# EAGLE schematic dig100-logic (EAGLE 7.2.0)
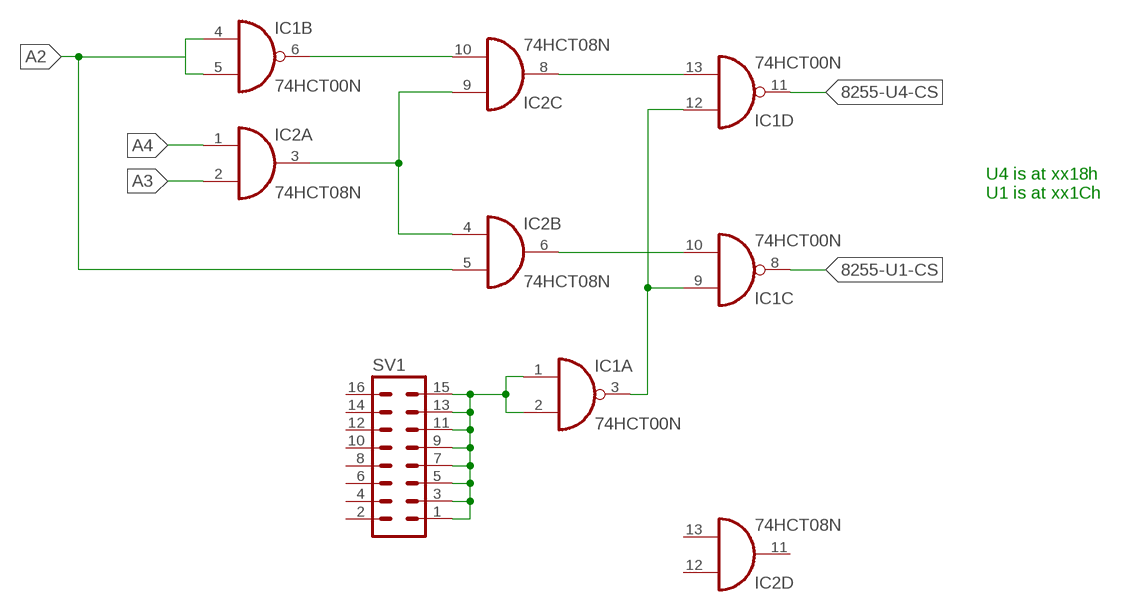
[diagram p0: schematic, sheet 1]

## Parts
IC1  74HCT00N  [DIL14]
IC2  74HCT08N  [DIL14]
SV1  MA08-2  [MA08-2]

## Nets
8255-U1-CS: IC1.8(C:O)
8255-U4-CS: IC1.11(D:O)
A2: IC1.4(B:I0) IC1.5(B:I1) IC2.5(B:I1)
A3: IC2.2(A:I1)
A4: IC2.1(A:I0)
N$1: IC1.6(B:O) IC2.10(C:I1)
N$2: IC2.3(A:O) IC2.4(B:I0) IC2.9(C:I0)
N$3: IC1.13(D:I1) IC2.8(C:O)
N$4: IC1.10(C:I1) IC2.6(B:O)
N$5: IC1.3(A:O) IC1.9(C:I0) IC1.12(D:I0)
N$6: IC1.1(A:I0) IC1.2(A:I1) SV1.1 SV1.3 SV1.5 SV1.7 SV1.9 SV1.11 SV1.13 SV1.15
Unconnected: IC2.11(D:O) IC2.12(D:I0) IC2.13(D:I1) SV1.2 SV1.4 SV1.6 SV1.8 SV1.10 SV1.12 SV1.14 SV1.16

## Notes on the sheet
- U4 is at xx18h
  U1 is at xx1Ch

## Power pins joined to a net without a drawn wire
GND: IC1.7(P:GND) IC2.7(P:GND)
VCC: IC1.14(P:VCC) IC2.14(P:VCC)

## Library data of the parts
IC1 = 74xx-eu:74*00: Quad 2-input NAND gate
IC2 = 74xx-eu:74*08: Quad 2-input AND gate
SV1 = con-lstb:MA08-2: PIN HEADER; OC_FARNELL: unknown; OC_NEWARK: unknown